# EAGLE design WakeOverWlan (EAGLE 6.6.0)
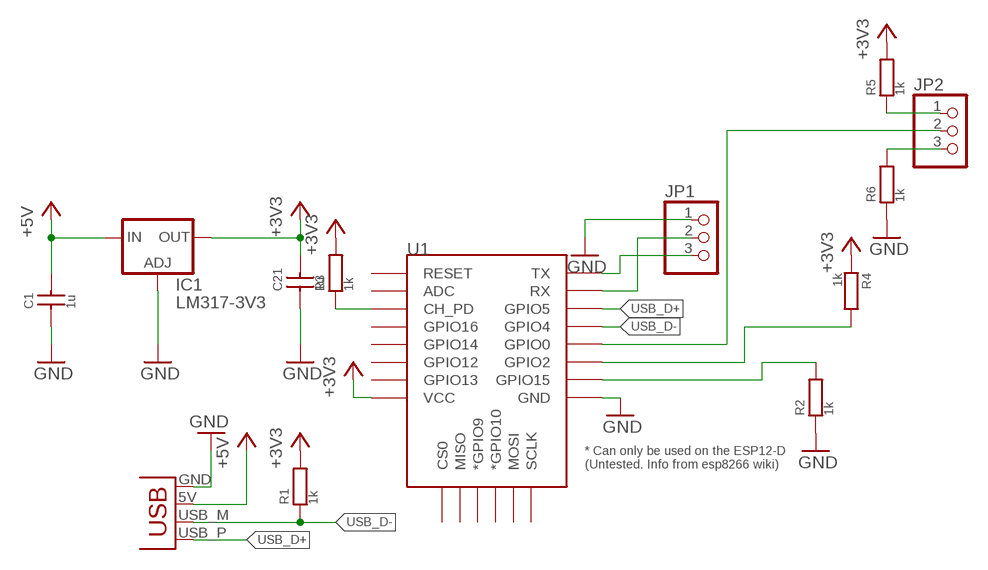
[diagram p0: schematic, sheet 1]

## Parts
C1  1u  C_SMD0805  [C0805]
C21  1u  C_SMD0805  [C0805]
IC1  LM317-3V3  LM317MBSTT3  [SOT223]
JP1  PINHD-1X3  [1X03]
JP2  PINHD-1X3  [1X03]
R1  1k  R0603  [R0603]
R2  1k  R0603  [R0603]
R3  1k  R0603  [R0603]
R4  1k  R0603  [R0603]
R5  1k  R0603  [R0603]
R6  1k  R0603  [R0603]
U1  ESP12ESMD  [ESP12E-SMD]
X1  USBPCB  [USB-A-PCB]

## Nets
+3V3: C21.2 IC1.4(OUT) R1.2 R3.2 R4.1 R5.2 U1.VCC
+5V: C1.2 IC1.3(IN) X1.5V(VBUS)
GND: C1.1 C21.1 IC1.1(ADJ) JP1.1 R2.1 R6.1 U1.GND X1.GND
N$1: R2.2 U1.GPIO15
N$2: R3.1 U1.CH_PD
N$3: R4.2 U1.GPIO2
N$4: JP2.2 U1.GPIO0
N$5: JP2.1 R5.1
N$6: JP2.3 R6.2
RX: JP1.2 U1.RXD0(RX)
TX: JP1.3 U1.TXD0(TX)
USB_D+: U1.GPIO5 X1.USB_P(D+)
USB_D-: R1.1 U1.GPIO4 X1.USB_M(D-)
Unconnected: U1.ADC U1.CS0 U1.GPIO9(*GPIO9) U1.GPIO10(*GPIO10) U1.GPIO12 U1.GPIO13 U1.GPIO14 U1.GPIO16 U1.MISO U1.MOSI U1.RESET U1.SCLK

## Library data of the parts
C1 C21 = SchlegelAr_Master:C_SMD: C SMD 0402, 0603, 0805, 1206 last modified: Armin Schlegel, 24.03.2014
IC1 = v-reg:LM317?*: 500 mA Adjustable Output Positive Voltage Regulator Source: http://www.onsemi.co.jp .. LM317M-D.PDF
JP1 JP2 = pinhead:PINHD-1X3: PIN HEADER
R1-R6 = SchlegelAr_Master:R: Widerstaende in 0402, 0603, 0805, 1206, 2512 last modified: Armin Schlegel, 28.04.2014
U1 = esp8266modules:ESP12E: ESP12E Module
X1 = usb:USB: USB Connectors USB-B-PTH is fully proven SKU : PRT-00139 USB-miniB is fully proven SKU : PRT-00587 USB-A-PCB is untested. USB-A-H is throughly reviewed, but untested. Spark Fun Electronics SKU : PRT-00437 USB-B-SMT is throughly reviewed, but untested. Needs silkscreen touching up. USB-A-S has not been used/tested USB-MB-H has not been used/tested

## Board
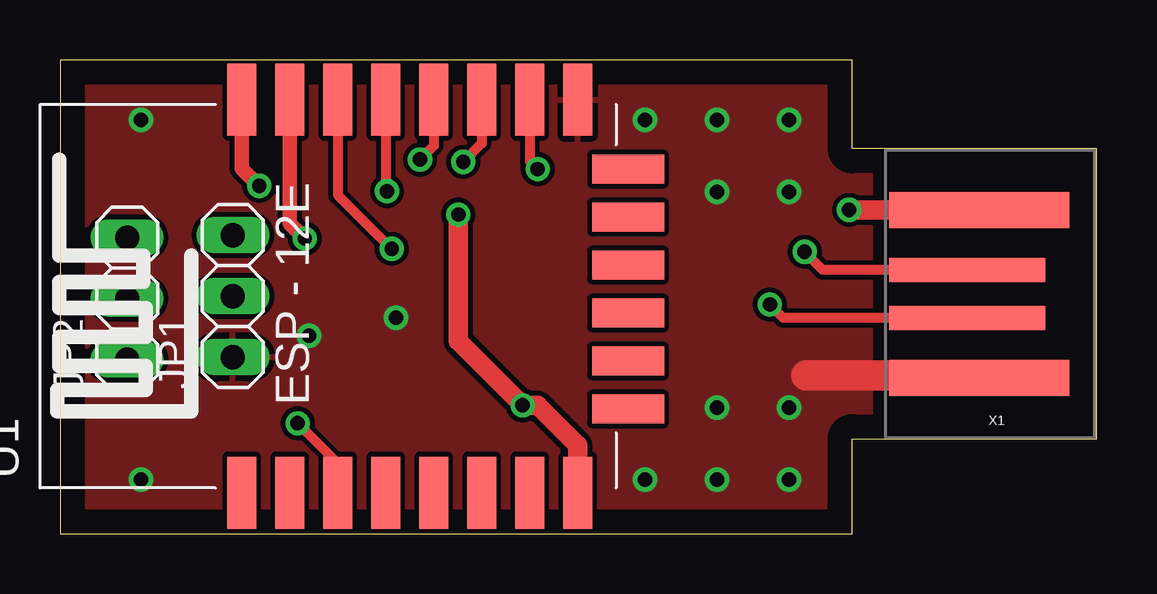
[diagram p1: board, top side]
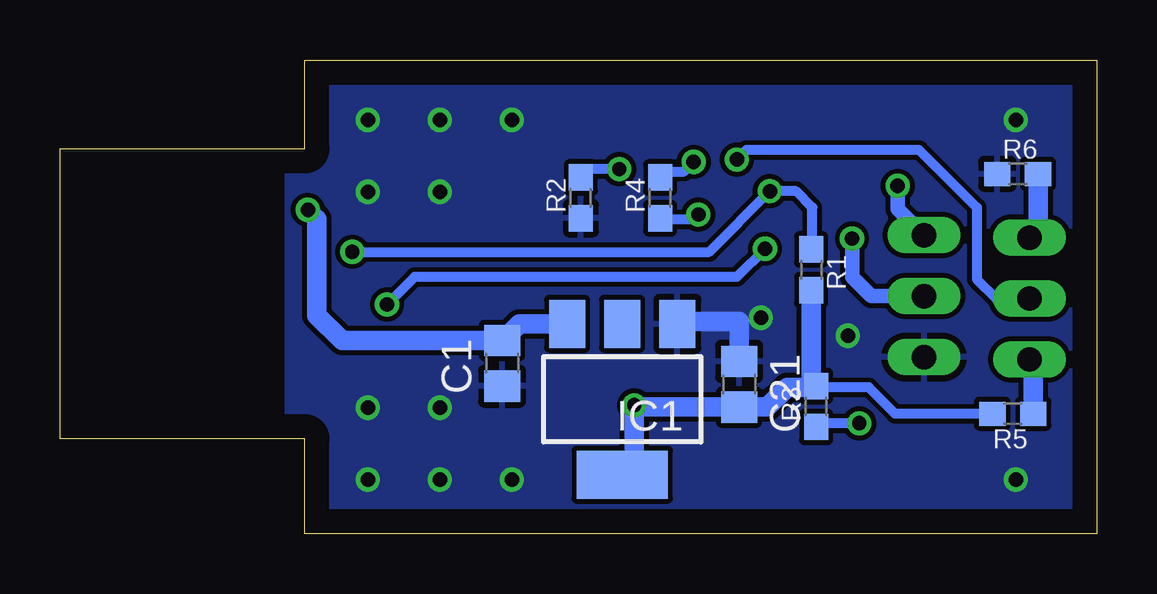
[diagram p2: board, bottom side, seen from below]

Size 43.2 x 19.75 mm. Coordinates in mm from the lower left corner, seen from the top.
Outline: 0,0 33,0 33,3.95 43.2,3.95 43.2,16.05 33,16.05 33,19.75 0,19.75 0,0
Copper layers (1*16): Top 0.035mm / dielectric 1.5mm / Bottom 0.035mm
Design rules "default": minimum track width 10mil, minimum drill 24mil, track to track 8mil, track to pad 8mil, pad to pad 8mil, via to via 8mil, smd to smd 8mil, copper to edge 40mil, drill to drill 8mil, minimum pad ring 10mil, minimum via ring 8mil, stop-mask expansion 4mil, vias tented up to drill 0mil, thermal gap 10mil

### Footprints (pad centres in the part's own frame; a part is rotated, then mirrored left to right if it is on the bottom)
C0805 = smd 1.3 x 1.5: 1 -0.95,0; 2 0.95,0
SOT223 = smd 1.5 x 2: 1 -2.3,-3.15; 2 0,-3.15; 3 2.3,-3.15 | smd 3.8 x 2: 4 0,3.15
1X03 = drill 1.016 long: 1 -2.54,0; 2 0,0; 3 2.54,0
R0603 = smd 1.1 x 1: 1 -0.85,0; 2 0.85,0
ESP12E-SMD = smd 3 x 1.2: ADC -8.3,3.8; CH_PD -8.3,1.8; GND 8.1,-8.2; GPIO0 8.1,-2.2; GPIO2 8.1,-4.2; GPIO4 8.1,-0.2; GPIO5 8.1,1.8; GPIO12 -8.3,-4.2; GPIO13 -8.3,-6.2; GPIO14 -8.3,-2.2; GPIO15 8.1,-6.2; GPIO16 -8.3,-0.2; RESET -8.3,5.8; RXD0 8.1,3.8; TXD0 8.1,5.8; VCC -8.3,-8.2 | smd 1.2 x 3: CS0 -4.8,-10.3; GPIO9 -0.8,-10.3; GPIO10 1.2,-10.3; MISO -2.8,-10.3; MOSI 3.2,-10.3; SCLK 5.2,-10.3
USB-A-PCB = smd 7.5 x 1.5: 5V -0.2,-3.5; GND -0.2,3.5 | smd 6.5 x 1: USB_M 0.3,-1; USB_P 0.3,1

### Placement (x,y rotation side)
C1  24.77,7.1 90 bottom
C21  14.9,6.22 270 bottom
IC1  19.77,5.6 180 bottom
JP1  7.2,9.9 90 top
JP2  2.8,9.8 90 top
R1  11.9,11 270 bottom
R2  21.5,14 90 bottom
R3  11.7,5.3 90 bottom
R4  18.2,14 90 bottom
R5  3.5,5 180 bottom
R6  3.3,15 0 bottom
U1  13.38,10 90 top
X1  38.1,10 180 top

### Tracks (layer width: path | path; a pad name or v marks a point on that pad's centre or on a via)
+3V3  (via drill 0.6)
  Top 0.813: U1.VCC 21.57,3.67 19.9,5.35 v19.27,5.35 16.6,8.03 v16.6,13.3
  Bottom 0.406: R4.1 18.15,13.1 16.8,13.1 v16.6,13.3 | R5.2 8.4,5 9.5,6.1 11.65,6.1 R3.2
  Bottom 0.813: IC1.4 19.27,2.95 v19.27,5.35 19.2,5.28 C21.2 13.72,5.28 12.9,6.1 11.75,6.1 R3.2 11.9,6.35 R1.2
+5V  (via drill 0.6)
  Top 0.813: X1.5V v32.88,13.5
  Bottom 0.813: IC1.3 24.07,8.75 C1.2 31.45,8.05 32.5,9.1 32.5,13.12 v32.88,13.5
GND  (via drill 0.6)
  Top 1.27: X1.GND 38.2,6.6 31.1,6.6
  Bottom 0.813: IC1.1 17.38,8.85 14.9,8.85 C21.1
  other vias: 10.38,8.25 14,9 27.38,5.25 30.38,5.25 27.38,2.25 30.38,2.25 27.38,17.25 30.38,17.25 24.38,2.25 3.38,2.25 3.38,17.25 24.38,17.25 27.38,14.25 30.38,14.25
  pour Bottom: 0,20.5 33,20.5 33,16 33.75,16 33.75,4 33,4 33,-0.75 0,-0.75
  pour Top: 0,20.5 33,20.5 33,16 33.75,16 33.75,4 33,4 33,-0.75 0,-0.75
N$1  (via drill 0.6)
  Top 0.406: U1.GPIO15 19.57,15.53 v19.9,15.2
  Bottom 0.406: v19.9,15.2 21.15,15.2 R2.2
N$2  (via drill 0.6)
  Top 0.406: U1.CH_PD 11.57,2.92 v9.9,4.6
  Bottom 0.406: v9.9,4.6 11.55,4.6 R3.1
N$3  (via drill 0.6)
  Top 0.406: U1.GPIO2 17.57,16.27 v16.8,15.5
  Bottom 0.406: R4.2 17.95,15.1 17.2,15.1 v16.8,15.5
N$4  (via drill 0.6)
  Top 0.406: U1.GPIO0 15.57,16.18 v15,15.6
  Bottom 0.406: JP2.2 4.2,9.8 5,10.6 5,13.6 7.4,16 14.6,16 v15,15.6
N$5
  Bottom 0.813: R5.1 2.65,7.11 JP2.1
N$6
  Bottom 0.813: R6.2 2.45,12.69 JP2.3
RX  (via drill 0.6)
  Top 0.61: U1.RXD0 9.57,12.93 v10.2,12.3
  Bottom 0.61: v10.2,12.3 10.2,10.7 9.4,9.9 JP1.2
TX  (via drill 0.6)
  Top 0.61: U1.TXD0 7.58,15.22 v8.3,14.5
  Bottom 0.61: v8.3,14.5 8.3,13.54 JP1.3
USB_D+  (via drill 0.6)
  Top 0.406: U1.GPIO5 11.57,14.12 v13.82,11.88 | X1.USB_P 30.12,9 v29.57,9.55
  Bottom 0.406: v29.57,9.55 28.43,10.7 16.5,10.7 16.1,10.7 15,10.7 v13.82,11.88
USB_D-  (via drill 0.6)
  Top 0.406: X1.USB_M 31.77,11 v31.02,11.75 | U1.GPIO4 13.57,14.32 v13.62,14.28
  Bottom 0.406: 11.85,11.9 11.85,13.6 12.53,14.28 v13.62,14.28 16.15,11.75 v31.02,11.75
  Bottom 0.813: R1.1 11.85,11.9